# EAGLE schematic module_core_3 (EAGLE 5.10)
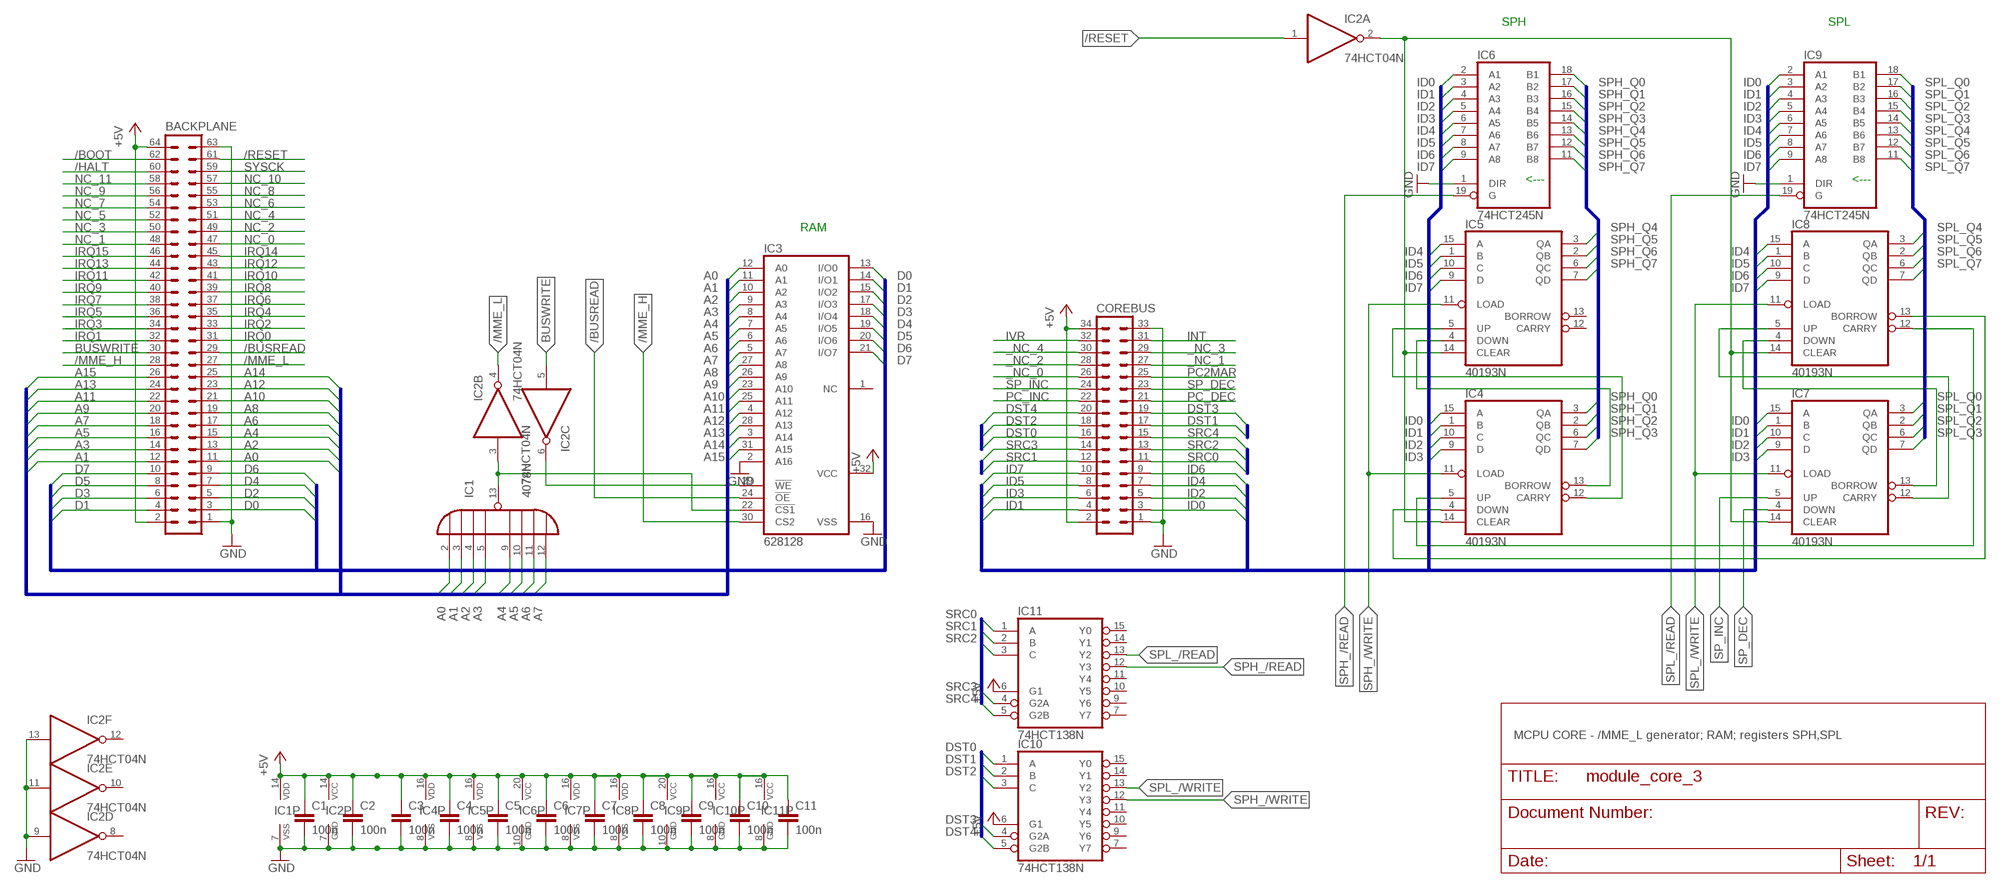
[diagram p0: schematic, sheet 1]

## Parts
BACKPLANE  ML64L  [ML64L]
C1  100n  C-EUC1206  [C1206]
C2  100n  C-EUC1206  [C1206]
C3  100n  C-EUC1206  [C1206]
C4  100n  C-EUC1206  [C1206]
C5  100n  C-EUC1206  [C1206]
C6  100n  C-EUC1206  [C1206]
C7  100n  C-EUC1206  [C1206]
C8  100n  C-EUC1206  [C1206]
C9  100n  C-EUC1206  [C1206]
C10  100n  C-EUC1206  [C1206]
C11  100n  C-EUC1206  [C1206]
COREBUS  ML34L  [ML34L]
IC1  4078N  [DIL14]
IC2  74HCT04N  [DIL14]
IC3  628128  628128P  [DIL32]
IC4  40193N  [DIL16]
IC5  40193N  [DIL16]
IC6  74HCT245N  [DIL20]
IC7  40193N  [DIL16]
IC8  40193N  [DIL16]
IC9  74HCT245N  [DIL20]
IC10  74HCT138N  [DIL16]
IC11  74HCT138N  [DIL16]

## Nets
+5V: BACKPLANE.2 BACKPLANE.64 C1.1 C2.1 C3.1 C4.1 C5.1 C6.1 C7.1 C8.1 C9.1 C10.1 C11.1 COREBUS.2 COREBUS.34 IC1.14(VDD) IC2.14(P:VCC) IC3.32(VCC) IC4.16(VDD) IC5.16(VDD) IC6.20(VCC) IC7.16(VDD) IC8.16(VDD) IC9.20(VCC) IC10.6(G1) IC10.16(VCC) IC11.6(G1) IC11.16(VCC)
/BOOT: BACKPLANE.62
/BUSREAD: BACKPLANE.29 IC3.24(!OE)
/HALT: BACKPLANE.60
/MME_H: BACKPLANE.28 IC3.30(CS2)
/MME_L: BACKPLANE.27 IC2.4(B:O)
/RESET: BACKPLANE.61 IC2.1(A:I)
_NC_0: COREBUS.26
_NC_1: COREBUS.27
_NC_2: COREBUS.28
_NC_3: COREBUS.29
_NC_4: COREBUS.30
A0: BACKPLANE.11 IC1.2(I0) IC3.12(A0)
A1: BACKPLANE.12 IC1.3(I1) IC3.11(A1)
A2: BACKPLANE.13 IC1.4(I2) IC3.10(A2)
A3: BACKPLANE.14 IC1.5(I3) IC3.9(A3)
A4: BACKPLANE.15 IC1.9(I4) IC3.8(A4)
A5: BACKPLANE.16 IC1.10(I5) IC3.7(A5)
A6: BACKPLANE.17 IC1.11(I6) IC3.6(A6)
A7: BACKPLANE.18 IC1.12(I7) IC3.5(A7)
A8: BACKPLANE.19 IC3.27(A8)
A9: BACKPLANE.20 IC3.26(A9)
A10: BACKPLANE.21 IC3.23(A10)
A11: BACKPLANE.22 IC3.25(A11)
A12: BACKPLANE.23 IC3.4(A12)
A13: BACKPLANE.24 IC3.28(A13)
A14: BACKPLANE.25 IC3.3(A14)
A15: BACKPLANE.26 IC3.31(A15)
BUSWRITE: BACKPLANE.30 IC2.5(C:I)
D0: BACKPLANE.3 IC3.13(I/O0)
D1: BACKPLANE.4 IC3.14(I/O1)
D2: BACKPLANE.5 IC3.15(I/O2)
D3: BACKPLANE.6 IC3.17(I/O3)
D4: BACKPLANE.7 IC3.18(I/O4)
D5: BACKPLANE.8 IC3.19(I/O5)
D6: BACKPLANE.9 IC3.20(I/O6)
D7: BACKPLANE.10 IC3.21(I/O7)
DST0: COREBUS.16 IC10.1(A)
DST1: COREBUS.17 IC10.2(B)
DST2: COREBUS.18 IC10.3(C)
DST3: COREBUS.19 IC10.4(G2A)
DST4: COREBUS.20 IC10.5(G2B)
GND: BACKPLANE.1 BACKPLANE.63 C1.2 C2.2 C3.2 C4.2 C5.2 C6.2 C7.2 C8.2 C9.2 C10.2 C11.2 COREBUS.1 COREBUS.33 IC1.7(VSS) IC2.7(P:GND) IC2.9(D:I) IC2.11(E:I) IC2.13(F:I) IC3.2(A16) IC3.16(VSS) IC4.8(VSS) IC5.8(VSS) IC6.1(DIR) IC6.10(GND) IC7.8(VSS) IC8.8(VSS) IC9.1(DIR) IC9.10(GND) IC10.8(GND) IC11.8(GND)
ID0: COREBUS.3 IC4.15(A) IC6.2(A1) IC7.15(A) IC9.2(A1)
ID1: COREBUS.4 IC4.1(B) IC6.3(A2) IC7.1(B) IC9.3(A2)
ID2: COREBUS.5 IC4.10(C) IC6.4(A3) IC7.10(C) IC9.4(A3)
ID3: COREBUS.6 IC4.9(D) IC6.5(A4) IC7.9(D) IC9.5(A4)
ID4: COREBUS.7 IC5.15(A) IC6.6(A5) IC8.15(A) IC9.6(A5)
ID5: COREBUS.8 IC5.1(B) IC6.7(A6) IC8.1(B) IC9.7(A6)
ID6: COREBUS.9 IC5.10(C) IC6.8(A7) IC8.10(C) IC9.8(A7)
ID7: COREBUS.10 IC5.9(D) IC6.9(A8) IC8.9(D) IC9.9(A8)
INT: COREBUS.31
IRQ0: BACKPLANE.31
IRQ1: BACKPLANE.32
IRQ2: BACKPLANE.33
IRQ3: BACKPLANE.34
IRQ4: BACKPLANE.35
IRQ5: BACKPLANE.36
IRQ6: BACKPLANE.37
IRQ7: BACKPLANE.38
IRQ8: BACKPLANE.39
IRQ9: BACKPLANE.40
IRQ10: BACKPLANE.41
IRQ11: BACKPLANE.42
IRQ12: BACKPLANE.43
IRQ13: BACKPLANE.44
IRQ14: BACKPLANE.45
IRQ15: BACKPLANE.46
IVR: COREBUS.32
N$3: IC2.6(C:O) IC3.29(!WE)
N$4: IC1.13(J) IC2.3(B:I) IC3.22(!CS1)
N$5: IC4.13(BORROW) IC5.4(DOWN)
N$6: IC4.12(CARRY) IC5.5(UP)
N$11: IC7.13(BORROW) IC8.4(DOWN)
N$12: IC7.12(CARRY) IC8.5(UP)
N$13: IC4.5(UP) IC8.12(CARRY)
N$14: IC4.4(DOWN) IC8.13(BORROW)
NC_0: BACKPLANE.47
NC_1: BACKPLANE.48
NC_2: BACKPLANE.49
NC_3: BACKPLANE.50
NC_4: BACKPLANE.51
NC_5: BACKPLANE.52
NC_6: BACKPLANE.53
NC_7: BACKPLANE.54
NC_8: BACKPLANE.55
NC_9: BACKPLANE.56
NC_10: BACKPLANE.57
NC_11: BACKPLANE.58
PC2MAR: COREBUS.25
PC_DEC: COREBUS.21
PC_INC: COREBUS.22
RESET: IC2.2(A:O) IC4.14(CLEAR) IC5.14(CLEAR) IC7.14(CLEAR) IC8.14(CLEAR)
SP_DEC: COREBUS.23 IC7.4(DOWN)
SP_INC: COREBUS.24 IC7.5(UP)
SPH_/READ: IC6.19(G) IC11.12(Y3)
SPH_/WRITE: IC4.11(LOAD) IC5.11(LOAD) IC10.12(Y3)
SPH_Q0: IC4.3(QA) IC6.18(B1)
SPH_Q1: IC4.2(QB) IC6.17(B2)
SPH_Q2: IC4.6(QC) IC6.16(B3)
SPH_Q3: IC4.7(QD) IC6.15(B4)
SPH_Q4: IC5.3(QA) IC6.14(B5)
SPH_Q5: IC5.2(QB) IC6.13(B6)
SPH_Q6: IC5.6(QC) IC6.12(B7)
SPH_Q7: IC5.7(QD) IC6.11(B8)
SPL_/READ: IC9.19(G) IC11.13(Y2)
SPL_/WRITE: IC7.11(LOAD) IC8.11(LOAD) IC10.13(Y2)
SPL_Q0: IC7.3(QA) IC9.18(B1)
SPL_Q1: IC7.2(QB) IC9.17(B2)
SPL_Q2: IC7.6(QC) IC9.16(B3)
SPL_Q3: IC7.7(QD) IC9.15(B4)
SPL_Q4: IC8.3(QA) IC9.14(B5)
SPL_Q5: IC8.2(QB) IC9.13(B6)
SPL_Q6: IC8.6(QC) IC9.12(B7)
SPL_Q7: IC8.7(QD) IC9.11(B8)
SRC0: COREBUS.11 IC11.1(A)
SRC1: COREBUS.12 IC11.2(B)
SRC2: COREBUS.13 IC11.3(C)
SRC3: COREBUS.14 IC11.4(G2A)
SRC4: COREBUS.15 IC11.5(G2B)
SYSCK: BACKPLANE.59
Unconnected: IC2.8(D:O) IC2.10(E:O) IC2.12(F:O) IC3.1(NC) IC5.12(CARRY) IC5.13(BORROW) IC10.7(Y7) IC10.9(Y6) IC10.10(Y5) IC10.11(Y4) IC10.14(Y1) IC10.15(Y0) IC11.7(Y7) IC11.9(Y6) IC11.10(Y5) IC11.11(Y4) IC11.14(Y1) IC11.15(Y0)

## Buses
D[0..7]
A[0..15]
ID[0..7]
SPH_Q[0..7]
SPL_Q[0..7]
DST[0..4]
SRC[0..4]

## Notes on the sheet
- SPH | SPL
- <--- | <---
- RAM
- MCPU CORE - /MME_L generator; RAM; registers SPH,SPL

## Library data of the parts
BACKPLANE = mcpu:ML64L: HARTING
C1-C11 = rcl:C-EU: CAPACITOR, European symbol
COREBUS = mcpu:ML34L: HARTING
IC1 = 40xx:4078: 8-input NOR
IC2 = 74xx-eu:74*04: Hex INVERTER
IC3 = memory-hitachi:628128P: MEMORY
IC4 IC5 IC7 IC8 = 40xx:40193: Binary up down COUNTER
IC6 IC9 = 74xx-eu:74*245: Octal BUS TRANSCEIVER, 3-state
IC10 IC11 = 74xx-eu:74*138: 3-line to 8-line DECODER/DEMULTIPLEXER

## Net classes
0 Signal: width 0.305 mm, drill 0.508 mm, clearance 0.203 mm
1 LoVolt42: width 0.61 mm, drill 0.508 mm, clearance 0.813 mm to class 0, clearance 0.305 mm
2 MedVolt100: width 0.61 mm, drill 0.508 mm, clearance 1.626 mm to class 0, clearance 1.626 mm to class 1, clearance 0.813 mm
3 LineVolt350: width 0.813 mm, drill 0.508 mm, clearance 12.7 mm to class 0, clearance 12.7 mm to class 1, clearance 12.7 mm to class 2, clearance 2.54 mm